# Altium schematic sheet AS_Node_Inputs.SchDoc
size A4
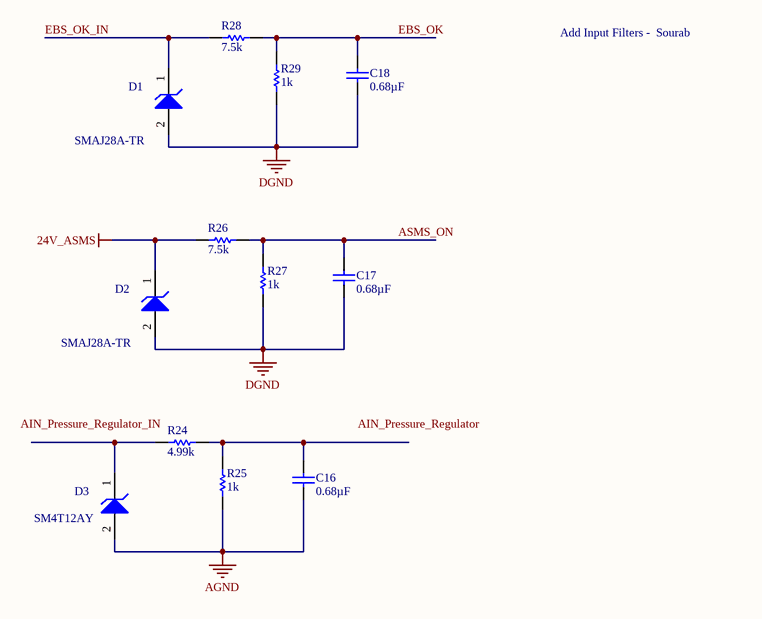
[diagram p0: AS_Node_Inputs.SchDoc]

## Parts
C16  0.68µF  [dV_C0805]
C17  0.68µF  [dV_C0805]
C18  0.68µF  [dV_C0805]
D1  Manufacturer Part Number: SMAJ28A-TR  [1SMA12AT3G]
D2  Manufacturer Part Number: SMAJ28A-TR  [1SMA12AT3G]
D3  Manufacturer Part Number: SM4T12AY  [1SMA12AT3G]
R24  4.99k  [dV_R0805]
R25  1k  [dV_R0805]
R26  7.5k  [dV_R0805]
R27  1k  [dV_R0805]
R28  7.5k  [dV_R0805]
R29  1k  [dV_R0805]

## Nets
24V_ASMS: D2.1(K) R26.2
AGND: C16.1 D3.2(A) R25.2
DGND: C17.1 C18.1 D1.2(A) D2.2(A) R27.2 R29.2
ASMS_ON: C17.2 R26.1 R27.1
EBS_OK: C18.2 R28.1 R29.1
EBS_OK_IN: D1.1(K) R28.2
NetC16_2: C16.2 R24.1 R25.1
NetD3_1: D3.1(K) R24.2

## Notes on the sheet
- Add Input Filters -  Sourab
- Labels drawn without touching a wire or pin: AIN_Pressure_Regulator, AIN_Pressure_Regulator_IN

## Library data of the parts
C16-C18 = Cap: Manufacturer: KEMET; Manufacturer Part Number: C0805C684J3NACTU; Ceramic Capacitor Case: 0805 [2012 Metric]; Voltage Rating: 25; Capacitance Tolerance: ± 5%; Dielectric Characteristic: X8; Product Range: C Series; SVHC: No SVHC (15-Jun-2015)<!--FANDB--><div class="features-and-benefits-container"><div class="features-and-benefits-desc-container"><span class="features-and-benefits-container-desc">SMD Multilayer Ceramic Capacitor, 0805 [2012 Metric], 0.68 µF, 25 V, ± 5%, X8L, C Series</span></div><div class="features-and-benefits-description"><span class="features-benefits-value">The X8L dielectric features a 150°C maximum operating temperature and is considered "general purpose high temperature." These components are fixed, ceramic dielectric capacitors suited for high temperature bypass and decoupling applications or frequency discriminating circuits where Q and stability of capacitance characteristics are not critical. X8L exhibits a predictable change in capacitance with respect to time and voltage and boasts a minimal change in capacitance with reference to ambient temperature up to 125°C. Beyond 125°C X8L displays a wider variation in capacitance. Capacitance change is limited to ±15% from ?55°C to +125°C and +15, ?40% from 125°C to 150°C.</span></div><div class="features-and-benefits-list"><ul class="features-and-benefits-list-list"><li class="features-and-benefits-list-item">Operating temperature range from -55°C to 150°C</li><li class="features-and-benefits-list-item">Capacitance values ranging from 0.012µF to 10µF</li><li class="features-and-benefits-list-item">EIA 0402, 0603, 0805, 1206 and 1210 case sizes available</li><li class="features-and-benefits-list-item">DC voltage rating of 10V, 16V, 25V and 50; Supplier 1: Farnell; Supplier Part Number 1: 2575955; RoHS: YES; Stock 1: 576; Pricing 1: 5=0.718, 50=0.419, 250=0.279, 500=0.228, 1000=0.193, 2500=0.186, 12500=0.179 (GBP); Capacitance: 0.68µF; Packaging: Cut Tape; Operating Temperature Min: -55; Operating Temperature Max: 150; Automotive Qualification Standard: -; MSL: MSL 1 - Unlimited; ComponentLink1URL: http://www.farnell.com/datasheets/2321109.pdf; ComponentLink1Description: http://www.farnell.com/datasheets/2321109.pdf; ComponentLink2URL: https://youtu.be/PxmtxV5n2KM?list=PLa3x8V-ZYWEUNRPUyCTjknYUhI9vvDZu9; ComponentLink2Description: https://youtu.be/PxmtxV5n2KM?list=PLa3x8V-ZYWEUNRPUyCTjknYUhI9vvDZu9; ComponentLink3URL: http://www.farnell.com/datasheets/2315665.pdf; ComponentLink3Description: http://www.farnell.com/datasheets/2315665.pdf; ComponentLink4URL: http://www.farnell.com/cad/2268906.zip; ComponentLink4Description: http://www.farnell.com/cad/2268906.zip
D1 D2 = TVS diodes: Manufacturer: STMICROELECTRONICS; Product Range: TRANSZORB SMAJ Series; TVS Polarity: Unidirectional; Reverse Stand-Off Voltage Vrwm: 28; Clamping Voltage Vc Max: 59; Diode Case Style: DO-214; No. of Pins: 2; Breakdown Voltage Min: 31.1; Breakdown Voltage Max: 32.7; Peak Pulse Power Dissipation: 400; SVHC: No SVHC (17-Dec-2015); Capacitance Cd @ Vr Typ: 510; Current Ir Max: 1; Diode Type: Unidirectional TVS; External Depth: 5.6; External Length / Height: 2.9; Forward Surge Current Ifsm Max: 40; Peak Pulse Current Ippm: 8.8; SMD Marking: CG; Stand-off Voltage: 28V<!--FANDB--><div class="features-and-benefits-container"><div class="features-and-benefits-desc-container"><span class="features-and-benefits-container-desc">TVS Diode, TRANSZORB SMAJ Series, Unidirectional, 28 V, 59 V, DO-214AC, 2 Pins</span></div><div class="features-and-benefits-description"><span class="features-benefits-value">The Transil SMAJ series TVS Diode designed to protect sensitive equipment against electrostatic discharges according to IEC 61000-4-2, MIL STD 883, method 3015 and electrical over stress according to IEC 61000-4-4 and 5. It is generally used against surges below 400W (10/1000?s). Planar technology makes these devices suitable for high-end equipment and SMPS where low leakage current and high junction temperature are required to provide reliability and stability over time.</span></div><div class="features-and-benefits-list"><ul class="features-and-benefits-list-list"><li class="features-and-benefits-list-item">5 to 188V Stand off voltage range</li><li class="features-and-benefits-list-item">0.2µA at 25°C and 1µA at 85°C Low leakage current</li><li class="features-and-benefits-list-item">270W (10/1000µs) High power capability at Tj max</li><li class="features-and-benefits-list-item">-55 to 150; Supplier 1: Farnell; Supplier Part Number 1: 9802797; RoHS: YES; Stock 1: 24650; Pricing 1: 10=0.143, 100=0.0657, 500=0.0652, 1000=0.0648, 2500=0.0643 (GBP); Packaging: Cut Tape; Automotive Qualification Standard: -; Alternate Case Style: DO-214; Breakover Voltage Min: 31.1; Clamping Voltage @ 8/20µs Max: 59; External Width: 2.9; MSL: MSL 1 - Unlimited; Power Dissipation Pd: 400; Reverse Leakage Current Max: 1; Reverse Voltage Vr Max: 28; ComponentLink1URL: http://www.farnell.com/datasheets/1724007.pdf; ComponentLink1Description: http://www.farnell.com/datasheets/1724007.pdf; ComponentLink2URL: http://www.farnell.com/datasheets/2158622.pdf; ComponentLink2Description: http://www.farnell.com/datasheets/2158622.pdf
D3 = TVS diodes: Manufacturer: STMICROELECTRONICS; Product Range: Transil SM4; TVS Polarity: Unidirectional; Reverse Stand-Off Voltage Vrwm: 10; Clamping Voltage Vc Max: 21.7; Diode Case Style: DO-214; No. of Pins: 2; Breakdown Voltage Min: 11.1; Breakdown Voltage Max: 12.3; Peak Pulse Power Dissipation: 400; Automotive Qualification Standard: AEC-Q101; SVHC: No SVHC (17-Dec-2015); Peak Pulse Current Ippm: 106; Power Dissipation Pd: 400W<!--FANDB--><div class="features-and-benefits-container"><div class="features-and-benefits-desc-container"><span class="features-and-benefits-container-desc">TVS Diode, Transil SM4TY Series, Unidirectional, 10 V, 21.7 V, DO-214AC, 2 Pins</span></div><div class="features-and-benefits-description"><span class="features-benefits-value">The Transil SM4TY series TVS Diode designed to protect sensitive automotive circuits against surges defined in ISO 7637-2 and against electrostatic discharges according to ISO 10605. The planar technology makes it compatible with high-end circuits where low leakage current and high junction temperature are required to provide reliability and stability over time.</span></div><div class="features-and-benefits-list"><ul class="features-and-benefits-list-list"><li class="features-and-benefits-list-item">5 to 70V Stand off voltage range</li><li class="features-and-benefits-list-item">Unidirectional and bidirectional types</li><li class="features-and-benefits-list-item">270W (10/1000µs) High power capability at Tj max</li><li class="features-and-benefits-list-item">-55 to 150; Supplier 1: Farnell; Supplier Part Number 1: 2327858; RoHS: YES; Stock 1: 1079; Pricing 1: 1=0.552, 25=0.511, 100=0.301, 250=0.277, 500=0.26, 1000=0.226, 3000=0.188, 9000=0.163 (GBP); Packaging: Cut Tape; MSL: MSL 1 - Unlimited; ComponentLink1URL: http://www.farnell.com/datasheets/1997806.pdf; ComponentLink1Description: http://www.farnell.com/datasheets/1997806.pdf
R24 = Res1: Manufacturer: PANASONIC ELECTRONIC COMPONENTS; Manufacturer Part Number: ERA6AEB4991V; Voltage Rating: 100; Resistor Element Material: Thin Film; Resistor Case Style: 0805 [2012 Metric]; Power Rating: 125; Resistance Tolerance: ± 0.1%; Product Range: ERA6; Temperature Coefficient: ± 25; Automotive Qualification Standard: AEC-Q200; SVHC: No SVHC (07-Jul-2017); External Depth: 1.25; External Length / Height: 0.5; External Width: 2; Resistor Mounting: Surface Mount Device<!--FANDB--><div class="features-and-benefits-container"><div class="features-and-benefits-desc-container"><span class="features-and-benefits-container-desc">SMD Chip Resistor, 4.99 kohm, 100 V, Thin Film, 0805 [2012 Metric], 125 mW, ± 0.1%</span></div><div class="features-and-benefits-description"><span class="features-benefits-value">The Panasonic ERA 6A series resistors are highly reliable, automotive grade metal film chip resistors based on thin film technology. The resistance range includes E24 and E96 decade values from 10 ohm to 1Mohm. ERA series metal thin film chip resistors have small resistance tolerance and temperature coefficient of resistance, low current noise and excellent linearity. These resistors are stable at high temperature and humidity.</span></div><div class="features-and-benefits-list"><ul class="features-and-benefits-list-list"><li class="features-and-benefits-list-item">EIA 0201, 0402, 0603, 0805, 1206 case sizes available</li><li class="features-and-benefits-list-item">Automotive grade AEC-Q200 compliant</li><li class="features-and-benefits-list-item">Meets IEC 60115-8, JIS C 5201-8, EIAJ RC-2133B standards</li><li class="features-and-benefits-list-item">85°C 85% RH rated load</li><li class="features-and-benefits-list-item">Maximum power rating of 250mW</li><li class="features-and-benefits-list-item">Available in ±0.05%, ±0.1%, ±0.25% and ±0.5% tolerance</li><li class="features-and-benefits-list-item">±10, ±15, ±25, ±50 and ±100ppm/°C TCR values available</li><li class="features-and-benefits-list-item">Operating temperature range -55°C to 155; Supplier 1: Farnell; Supplier Part Number 1: 1810573; RoHS: YES; Stock 1: 6882; Pricing 1: 10=0.237, 100=0.0981, 500=0.08, 1000=0.0553, 2500=0.0492 (GBP); Resistance: 4.99k; Packaging: Cut Tape; No. of Pins: 2; Operating Temperature Max: 155; Operating Temperature Min: -55; Operating Temperature Range: -55°C to +155; ComponentLink1URL: http://www.farnell.com/datasheets/2052875.pdf; ComponentLink1Description: http://www.farnell.com/datasheets/2052875.pdf; ComponentLink2URL: http://www.farnell.com/datasheets/1718548.pdf; ComponentLink2Description: http://www.farnell.com/datasheets/1718548.pdf; ComponentLink3URL: http://www.farnell.com/cad/1697890.zip; ComponentLink3Description: http://www.farnell.com/cad/1697890.zip
R25 R27 R29 = Res1: Manufacturer: PANASONIC ELECTRONIC COMPONENTS; Manufacturer Part Number: ERA6AEB102V; Voltage Rating: 100; Resistor Element Material: Thin Film; Resistor Case Style: 0805 [2012 Metric]; Power Rating: 125; Resistance Tolerance: ± 0.1%; Product Range: ERA6; Temperature Coefficient: ± 25; Automotive Qualification Standard: AEC-Q200; SVHC: No SVHC (07-Jul-2017)<!--FANDB--><div class="features-and-benefits-container"><div class="features-and-benefits-desc-container"><span class="features-and-benefits-container-desc">SMD Chip Resistor, 1 kohm, 100 V, Thin Film, 0805 [2012 Metric], 125 mW, ± 0.1%</span></div><div class="features-and-benefits-description"><span class="features-benefits-value">The Panasonic ERA 6A series resistors are highly reliable, automotive grade metal film chip resistors based on thin film technology. The resistance range includes E24 and E96 decade values from 10 ohm to 1Mohm. ERA series metal thin film chip resistors have small resistance tolerance and temperature coefficient of resistance, low current noise and excellent linearity. These resistors are stable at high temperature and humidity.</span></div><div class="features-and-benefits-list"><ul class="features-and-benefits-list-list"><li class="features-and-benefits-list-item">EIA 0201, 0402, 0603, 0805, 1206 case sizes available</li><li class="features-and-benefits-list-item">Automotive grade AEC-Q200 compliant</li><li class="features-and-benefits-list-item">Meets IEC 60115-8, JIS C 5201-8, EIAJ RC-2133B standards</li><li class="features-and-benefits-list-item">85°C 85% RH rated load</li><li class="features-and-benefits-list-item">Maximum power rating of 250mW</li><li class="features-and-benefits-list-item">Available in ±0.05%, ±0.1%, ±0.25% and ±0.5% tolerance</li><li class="features-and-benefits-list-item">±10, ±15, ±25, ±50 and ±100ppm/°C TCR values available</li><li class="features-and-benefits-list-item">Operating temperature range -55°C to 155; Supplier 1: Farnell; Supplier Part Number 1: 1577659; RoHS: YES; Stock 1: 58725; Pricing 1: 10=0.237, 100=0.0981, 500=0.08, 1000=0.0551, 2500=0.0482 (GBP); Resistance: 1k; Packaging: Cut Tape; ComponentLink1URL: http://www.farnell.com/datasheets/2052875.pdf; ComponentLink1Description: http://www.farnell.com/datasheets/2052875.pdf; ComponentLink2URL: http://www.farnell.com/datasheets/1718548.pdf; ComponentLink2Description: http://www.farnell.com/datasheets/1718548.pdf; ComponentLink3URL: http://www.farnell.com/cad/1684671.zip; ComponentLink3Description: http://www.farnell.com/cad/1684671.zip
R26 R28 = Res1: Manufacturer: PANASONIC ELECTRONIC COMPONENTS; Manufacturer Part Number: ERA6AEB752V; Voltage Rating: 100; Resistor Element Material: Thin Film; Resistor Case Style: 0805 [2012 Metric]; Power Rating: 125; Resistance Tolerance: ± 0.1%; Product Range: ERA6; Temperature Coefficient: ± 25; Automotive Qualification Standard: AEC-Q200; SVHC: No SVHC (07-Jul-2017); No. of Pins: 2; Resistor Mounting: Surface Mount Device<!--FANDB--><div class="features-and-benefits-container"><div class="features-and-benefits-desc-container"><span class="features-and-benefits-container-desc">SMD Chip Resistor, 7.5 kohm, 100 V, Thin Film, 0805 [2012 Metric], 125 mW, ± 0.1%</span></div><div class="features-and-benefits-description"><span class="features-benefits-value">The Panasonic ERA 6A series resistors are highly reliable, automotive grade metal film chip resistors based on thin film technology. The resistance range includes E24 and E96 decade values from 10 ohm to 1Mohm. ERA series metal thin film chip resistors have small resistance tolerance and temperature coefficient of resistance, low current noise and excellent linearity. These resistors are stable at high temperature and humidity.</span></div><div class="features-and-benefits-list"><ul class="features-and-benefits-list-list"><li class="features-and-benefits-list-item">EIA 0201, 0402, 0603, 0805, 1206 case sizes available</li><li class="features-and-benefits-list-item">Automotive grade AEC-Q200 compliant</li><li class="features-and-benefits-list-item">Meets IEC 60115-8, JIS C 5201-8, EIAJ RC-2133B standards</li><li class="features-and-benefits-list-item">85°C 85% RH rated load</li><li class="features-and-benefits-list-item">Maximum power rating of 250mW</li><li class="features-and-benefits-list-item">Available in ±0.05%, ±0.1%, ±0.25% and ±0.5% tolerance</li><li class="features-and-benefits-list-item">±10, ±15, ±25, ±50 and ±100ppm/°C TCR values available</li><li class="features-and-benefits-list-item">Operating temperature range -55°C to 155; Supplier 1: Farnell; Supplier Part Number 1: 1670239; RoHS: YES; Stock 1: 4190; Pricing 1: 10=0.237, 100=0.0981, 500=0.08, 1000=0.0553, 2500=0.0492 (GBP); Resistance: 7.5k; Packaging: Cut Tape; Operating Temperature Max: 155; Operating Temperature Min: -55; Operating Temperature Range: -55°C to +155; ComponentLink1URL: http://www.farnell.com/datasheets/2052875.pdf; ComponentLink1Description: http://www.farnell.com/datasheets/2052875.pdf; ComponentLink2URL: http://www.farnell.com/datasheets/1718548.pdf; ComponentLink2Description: http://www.farnell.com/datasheets/1718548.pdf; ComponentLink3URL: http://www.farnell.com/cad/1559844.zip; ComponentLink3Description: http://www.farnell.com/cad/1559844.zip